# Altium project MZTS_V0.1.PrjPcb
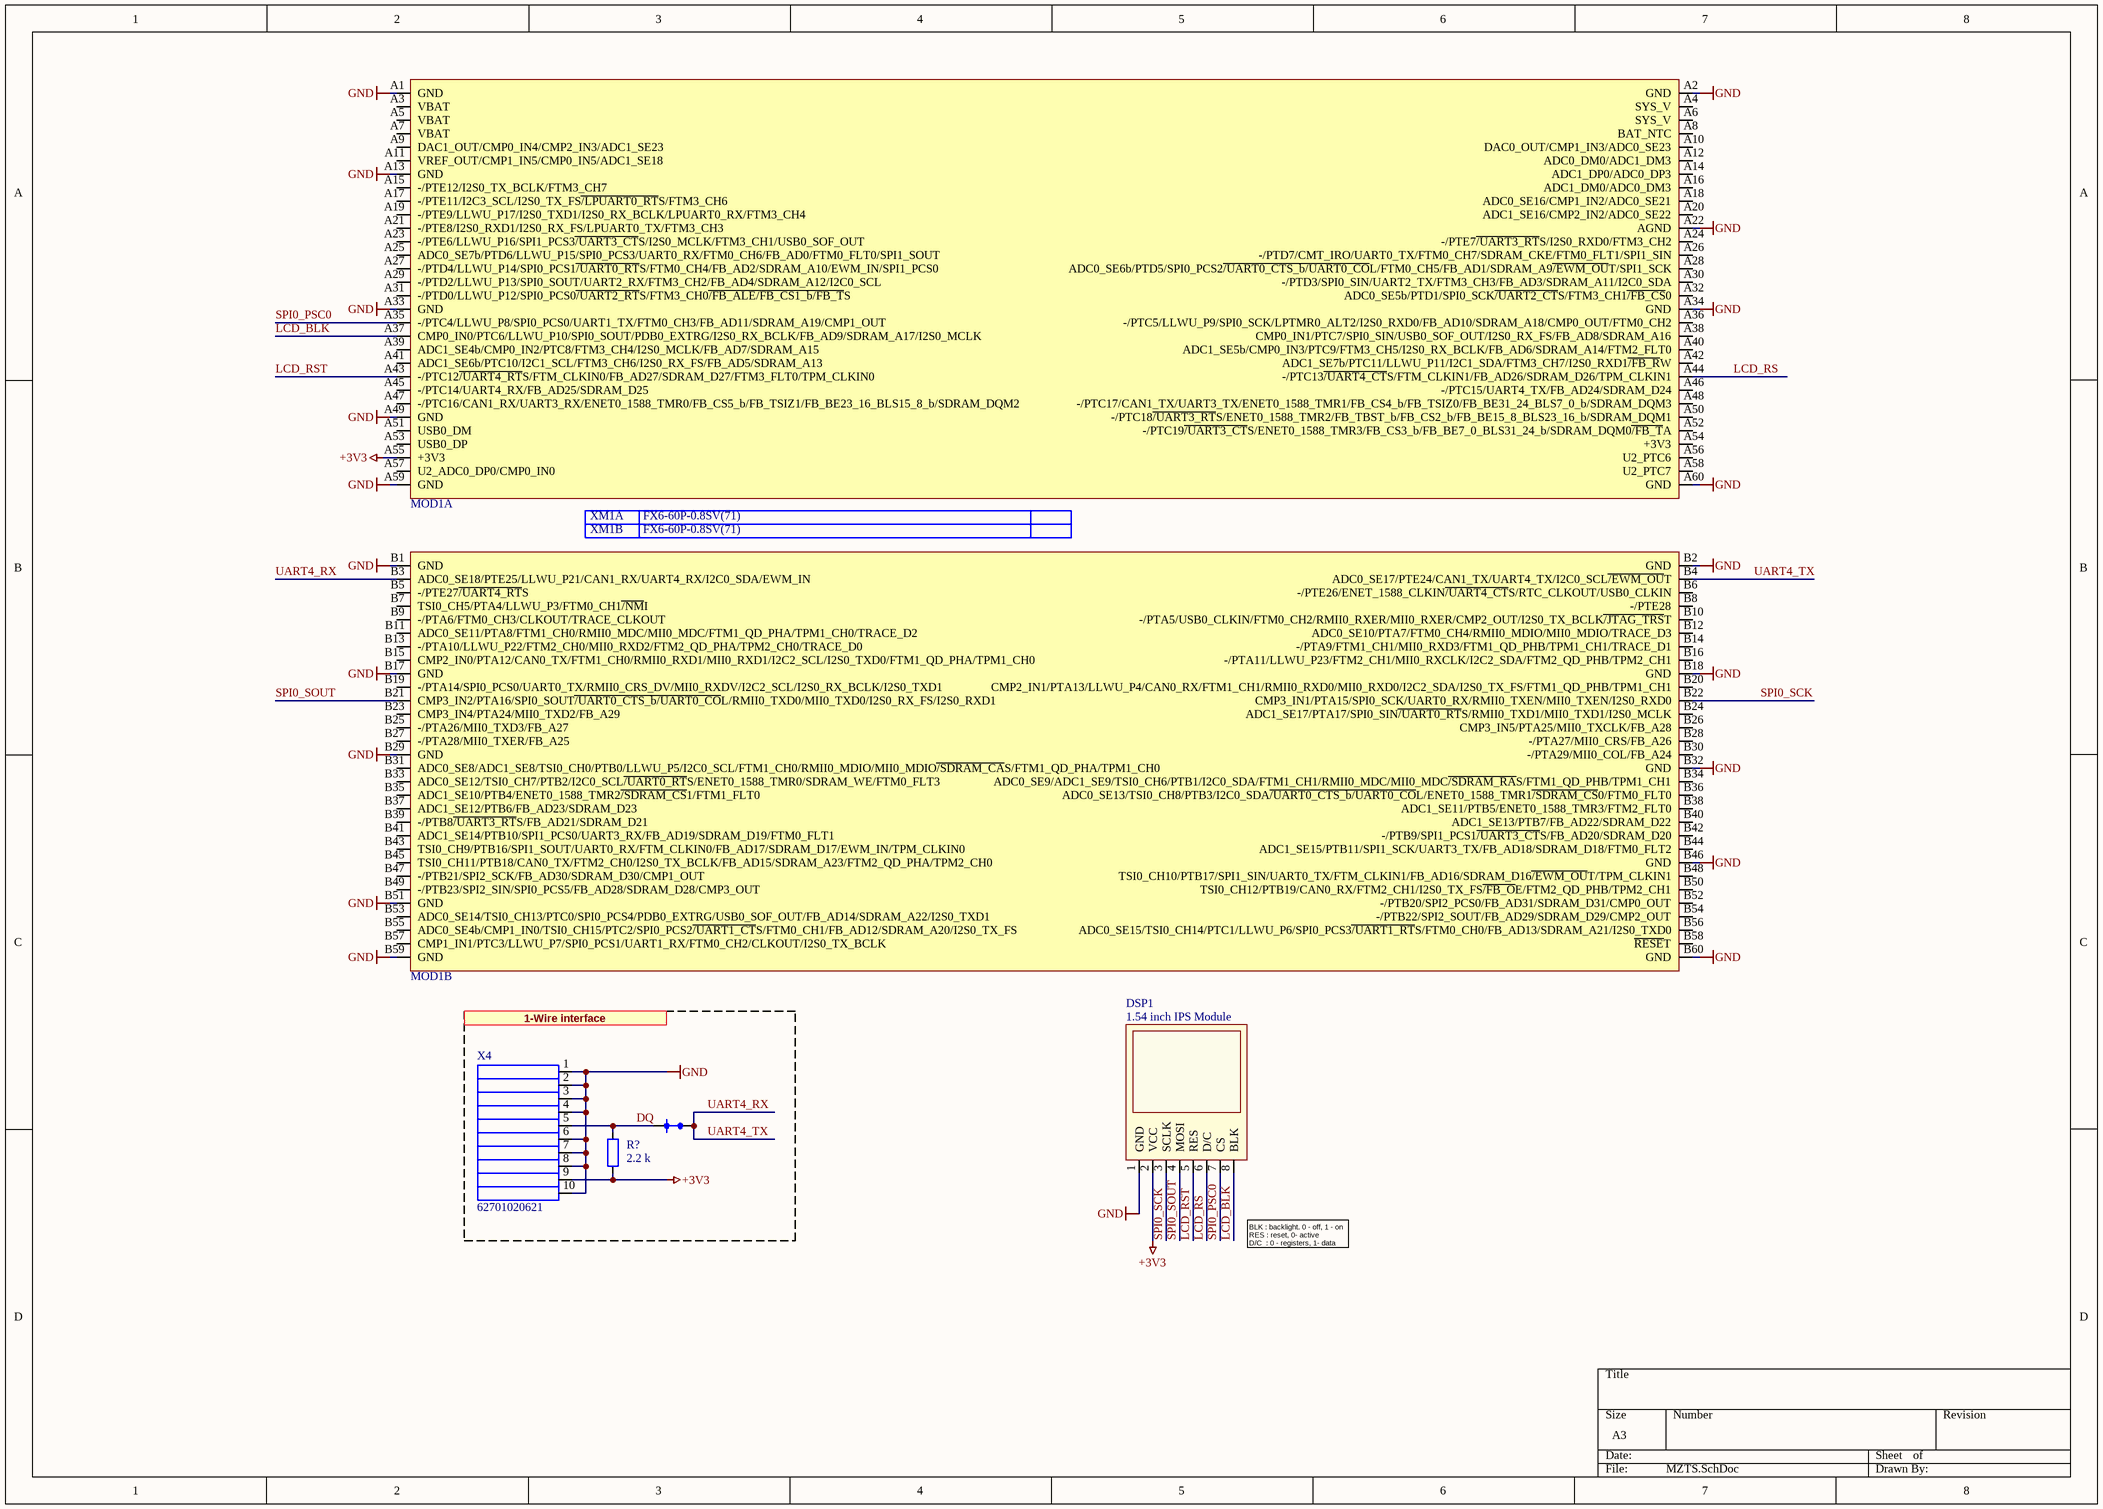
[diagram p0: MZTS.SchDoc]
1 sheet, 7 parts. Net scope: global (net labels, ports and power ports of the same name join across sheets).

## Sheet MZTS.SchDoc
size A3; SheetNumber: 1; SheetTotal: 1

### Parts
B?  Net tie 0603  [Net tee 0603]  (value not drawn)  (net tie, no BOM)
DSP1  PartName: 1.54 inch IPS Module  [1.54" IPS 240x240]  (hidden comment: 1.54_inch_IPS_Module)
MOD1  K66BLEZv1  [K66BLEZv1.0]  (value not drawn)  (parts A,B of 2)  (no BOM)
R?  value 2.2 k  [0603]  (hidden comment: Resistor)
X4  62701020621  [SHF-105-01-L-D-SM]
XM1A  FX6-60P-0.8SV(71)
XM1B  FX6-60P-0.8SV(71)

### Nets
+3V3: DSP1.2(VCC) MOD1.A55(+3V3) R?.1 X4.9
GND: DSP1.1(GND) MOD1.A1(GND) MOD1.A2(GND) MOD1.A13(GND) MOD1.A22(AGND) MOD1.A33(GND) MOD1.A34(GND) MOD1.A49(GND) MOD1.A59(GND) MOD1.A60(GND) MOD1.B1(GND) MOD1.B2(GND) MOD1.B17(GND) MOD1.B18(GND) MOD1.B29(GND) MOD1.B32(GND) MOD1.B46(GND) MOD1.B51(GND) MOD1.B59(GND) MOD1.B60(GND) X4.1 X4.2 X4.3 X4.4 X4.6 X4.7 X4.8 X4.10
DQ: B?.1 R?.2 X4.5
LCD_BLK: DSP1.8(BLK) MOD1.A37(CMP0_IN0/PTC6/LLWU_P10/SPI0_SOUT/PDB0_EXTRG/I2S0_RX_BCLK/FB_AD9/SDRAM_A17/I2S0_MCLK)
LCD_RS: DSP1.6(D/C) MOD1.A44(-/PTC13~{/UART4_CT}S/FTM_CLKIN1/FB_AD26/SDRAM_D26/TPM_CLKIN1)
LCD_RST: DSP1.5(RES) MOD1.A43(-/PTC12~{/UART4_RT}S/FTM_CLKIN0/FB_AD27/SDRAM_D27/FTM3_FLT0/TPM_CLKIN0)
SPI0_PSC0: DSP1.7(CS) MOD1.A35(-/PTC4/LLWU_P8/SPI0_PCS0/UART1_TX/FTM0_CH3/FB_AD11/SDRAM_A19/CMP1_OUT)
SPI0_SCK: DSP1.3(SCLK) MOD1.B22(CMP3_IN1/PTA15/SPI0_SCK/UART0_RX/RMII0_TXEN/MII0_TXEN/I2S0_RXD0)
SPI0_SOUT: DSP1.4(MOSI) MOD1.B21(CMP3_IN2/PTA16/SPI0_SOUT~{/UART0_CTS_b/UART0_CO}L/RMII0_TXD0/MII0_TXD0/I2S0_RX_FS/I2S0_RXD1)
UART4_RX: B?.2 MOD1.B3(ADC0_SE18/PTE25/LLWU_P21/CAN1_RX/UART4_RX/I2C0_SDA/EWM_IN) MOD1.B4(ADC0_SE17/PTE24/CAN1_TX/UART4_TX/I2C0_SCL~{/EWM_OU}T)  [also labelled UART4_TX]

Not connected (* = marked no-connect by the designer): MOD1 A3(VBAT) A4(SYS_V) A5(VBAT) A6(SYS_V) A7(VBAT) A8(BAT_NTC) A9(DAC1_OUT/CMP0_IN4/CMP2_IN3/ADC1_SE23) A10(DAC0_OUT/CMP1_IN3/ADC0_SE23) A11(VREF_OUT/CMP1_IN5/CMP0_IN5/ADC1_SE18) A12(ADC0_DM0/ADC1_DM3) A14(ADC1_DP0/ADC0_DP3) A15(-/PTE12/I2S0_TX_BCLK/FTM3_CH7) A16(ADC1_DM0/ADC0_DM3) A17(-/PTE11/I2C3_SCL/I2S0_TX_FS~{/LPUART0_RT}S/FTM3_CH6) A18(ADC0_SE16/CMP1_IN2/ADC0_SE21) A19(-/PTE9/LLWU_P17/I2S0_TXD1/I2S0_RX_BCLK/LPUART0_RX/FTM3_CH4) A20(ADC1_SE16/CMP2_IN2/ADC0_SE22) A21(-/PTE8/I2S0_RXD1/I2S0_RX_FS/LPUART0_TX/FTM3_CH3) A23(-/PTE6/LLWU_P16/SPI1_PCS3~{/UART3_CT}S/I2S0_MCLK/FTM3_CH1/USB0_SOF_OUT) A24(-/PTE7~{/UART3_RT}S/I2S0_RXD0/FTM3_CH2) A25(ADC0_SE7b/PTD6/LLWU_P15/SPI0_PCS3/UART0_RX/FTM0_CH6/FB_AD0/FTM0_FLT0/SPI1_SOUT) A26(-/PTD7/CMT_IRO/UART0_TX/FTM0_CH7/SDRAM_CKE/FTM0_FLT1/SPI1_SIN) A27(-/PTD4/LLWU_P14/SPI0_PCS1~{/UART0_RT}S/FTM0_CH4/FB_AD2/SDRAM_A10/EWM_IN/SPI1_PCS0) A28(ADC0_SE6b/PTD5/SPI0_PCS2~{/UART0_CTS_b/UART0_CO}L/FTM0_CH5/FB_AD1/SDRAM_A9~{/EWM_OU}T/SPI1_SCK) A29(-/PTD2/LLWU_P13/SPI0_SOUT/UART2_RX/FTM3_CH2/FB_AD4/SDRAM_A12/I2C0_SCL) A30(-/PTD3/SPI0_SIN/UART2_TX/FTM3_CH3/FB_AD3/SDRAM_A11/I2C0_SDA) A31(-/PTD0/LLWU_P12/SPI0_PCS0~{/UART2_RT}S/FTM3_CH0~{/FB_ALE/FB_CS1_b/FB_T}S) A32(ADC0_SE5b/PTD1/SPI0_SCK~{/UART2_CT}S/FTM3_CH1~{/FB_CS}0) A36(-/PTC5/LLWU_P9/SPI0_SCK/LPTMR0_ALT2/I2S0_RXD0/FB_AD10/SDRAM_A18/CMP0_OUT/FTM0_CH2) A38(CMP0_IN1/PTC7/SPI0_SIN/USB0_SOF_OUT/I2S0_RX_FS/FB_AD8/SDRAM_A16) A39(ADC1_SE4b/CMP0_IN2/PTC8/FTM3_CH4/I2S0_MCLK/FB_AD7/SDRAM_A15) A40(ADC1_SE5b/CMP0_IN3/PTC9/FTM3_CH5/I2S0_RX_BCLK/FB_AD6/SDRAM_A14/FTM2_FLT0) A41(ADC1_SE6b/PTC10/I2C1_SCL/FTM3_CH6/I2S0_RX_FS/FB_AD5/SDRAM_A13) A42(ADC1_SE7b/PTC11/LLWU_P11/I2C1_SDA/FTM3_CH7/I2S0_RXD1~{/FB_R}W) A45(-/PTC14/UART4_RX/FB_AD25/SDRAM_D25) A46(-/PTC15/UART4_TX/FB_AD24/SDRAM_D24) A47(-/PTC16/CAN1_RX/UART3_RX/ENET0_1588_TMR0/FB_CS5_b/FB_TSIZ1/FB_BE23_16_BLS15_8_b/SDRAM_DQM2) A48(-/PTC17/CAN1_TX/UART3_TX/ENET0_1588_TMR1/FB_CS4_b/FB_TSIZ0/FB_BE31_24_BLS7_0_b/SDRAM_DQM3) A50(-/PTC18~{/UART3_RT}S/ENET0_1588_TMR2/FB_TBST_b/FB_CS2_b/FB_BE15_8_BLS23_16_b/SDRAM_DQM1) A51(USB0_DM) A52(-/PTC19~{/UART3_CT}S/ENET0_1588_TMR3/FB_CS3_b/FB_BE7_0_BLS31_24_b/SDRAM_DQM0~{/FB_T}A) A53(USB0_DP) A54(+3V3) A56(U2_PTC6) A57(U2_ADC0_DP0/CMP0_IN0) A58(U2_PTC7) B5(-/PTE27~{/UART4_RT}S) B6(-/PTE26/ENET_1588_CLKIN~{/UART4_CT}S/RTC_CLKOUT/USB0_CLKIN) B7(TSI0_CH5/PTA4/LLWU_P3/FTM0_CH1~{/NM}I) B8(-/PTE28) B9(-/PTA6/FTM0_CH3/CLKOUT/TRACE_CLKOUT) B10(-/PTA5/USB0_CLKIN/FTM0_CH2/RMII0_RXER/MII0_RXER/CMP2_OUT/I2S0_TX_BCLK~{/JTAG_TRS}T) B11(ADC0_SE11/PTA8/FTM1_CH0/RMII0_MDC/MII0_MDC/FTM1_QD_PHA/TPM1_CH0/TRACE_D2) B12(ADC0_SE10/PTA7/FTM0_CH4/RMII0_MDIO/MII0_MDIO/TRACE_D3) B13(-/PTA10/LLWU_P22/FTM2_CH0/MII0_RXD2/FTM2_QD_PHA/TPM2_CH0/TRACE_D0) B14(-/PTA9/FTM1_CH1/MII0_RXD3/FTM1_QD_PHB/TPM1_CH1/TRACE_D1) B15(CMP2_IN0/PTA12/CAN0_TX/FTM1_CH0/RMII0_RXD1/MII0_RXD1/I2C2_SCL/I2S0_TXD0/FTM1_QD_PHA/TPM1_CH0) B16(-/PTA11/LLWU_P23/FTM2_CH1/MII0_RXCLK/I2C2_SDA/FTM2_QD_PHB/TPM2_CH1) B19(-/PTA14/SPI0_PCS0/UART0_TX/RMII0_CRS_DV/MII0_RXDV/I2C2_SCL/I2S0_RX_BCLK/I2S0_TXD1) B20(CMP2_IN1/PTA13/LLWU_P4/CAN0_RX/FTM1_CH1/RMII0_RXD0/MII0_RXD0/I2C2_SDA/I2S0_TX_FS/FTM1_QD_PHB/TPM1_CH1) B23(CMP3_IN4/PTA24/MII0_TXD2/FB_A29) B24(ADC1_SE17/PTA17/SPI0_SIN~{/UART0_RT}S/RMII0_TXD1/MII0_TXD1/I2S0_MCLK) B25(-/PTA26/MII0_TXD3/FB_A27) B26(CMP3_IN5/PTA25/MII0_TXCLK/FB_A28) B27(-/PTA28/MII0_TXER/FB_A25) B28(-/PTA27/MII0_CRS/FB_A26) B30(-/PTA29/MII0_COL/FB_A24) B31(ADC0_SE8/ADC1_SE8/TSI0_CH0/PTB0/LLWU_P5/I2C0_SCL/FTM1_CH0/RMII0_MDIO/MII0_MDIO~{/SDRAM_CA}S/FTM1_QD_PHA/TPM1_CH0) B33(ADC0_SE12/TSI0_CH7/PTB2/I2C0_SCL~{/UART0_RT}S/ENET0_1588_TMR0/SDRAM_WE/FTM0_FLT3) B34(ADC0_SE9/ADC1_SE9/TSI0_CH6/PTB1/I2C0_SDA/FTM1_CH1/RMII0_MDC/MII0_MDC~{/SDRAM_RA}S/FTM1_QD_PHB/TPM1_CH1) B35(ADC1_SE10/PTB4/ENET0_1588_TMR2~{/SDRAM_CS}1/FTM1_FLT0) B36(ADC0_SE13/TSI0_CH8/PTB3/I2C0_SDA~{/UART0_CTS_b/UART0_CO}L/ENET0_1588_TMR1~{/SDRAM_CS}0/FTM0_FLT0) B37(ADC1_SE12/PTB6/FB_AD23/SDRAM_D23) B38(ADC1_SE11/PTB5/ENET0_1588_TMR3/FTM2_FLT0) B39(-/PTB8~{/UART3_RT}S/FB_AD21/SDRAM_D21) B40(ADC1_SE13/PTB7/FB_AD22/SDRAM_D22) B41(ADC1_SE14/PTB10/SPI1_PCS0/UART3_RX/FB_AD19/SDRAM_D19/FTM0_FLT1) B42(-/PTB9/SPI1_PCS1~{/UART3_CT}S/FB_AD20/SDRAM_D20) B43(TSI0_CH9/PTB16/SPI1_SOUT/UART0_RX/FTM_CLKIN0/FB_AD17/SDRAM_D17/EWM_IN/TPM_CLKIN0) B44(ADC1_SE15/PTB11/SPI1_SCK/UART3_TX/FB_AD18/SDRAM_D18/FTM0_FLT2) B45(TSI0_CH11/PTB18/CAN0_TX/FTM2_CH0/I2S0_TX_BCLK/FB_AD15/SDRAM_A23/FTM2_QD_PHA/TPM2_CH0) B47(-/PTB21/SPI2_SCK/FB_AD30/SDRAM_D30/CMP1_OUT) B48(TSI0_CH10/PTB17/SPI1_SIN/UART0_TX/FTM_CLKIN1/FB_AD16/SDRAM_D16~{/EWM_OU}T/TPM_CLKIN1) B49(-/PTB23/SPI2_SIN/SPI0_PCS5/FB_AD28/SDRAM_D28/CMP3_OUT) B50(TSI0_CH12/PTB19/CAN0_RX/FTM2_CH1/I2S0_TX_FS~{/FB_O}E/FTM2_QD_PHB/TPM2_CH1) B52(-/PTB20/SPI2_PCS0/FB_AD31/SDRAM_D31/CMP0_OUT) B53(ADC0_SE14/TSI0_CH13/PTC0/SPI0_PCS4/PDB0_EXTRG/USB0_SOF_OUT/FB_AD14/SDRAM_A22/I2S0_TXD1) B54(-/PTB22/SPI2_SOUT/FB_AD29/SDRAM_D29/CMP2_OUT) B55(ADC0_SE4b/CMP1_IN0/TSI0_CH15/PTC2/SPI0_PCS2~{/UART1_CT}S/FTM0_CH1/FB_AD12/SDRAM_A20/I2S0_TX_FS) B56(ADC0_SE15/TSI0_CH14/PTC1/LLWU_P6/SPI0_PCS3~{/UART1_RT}S/FTM0_CH0/FB_AD13/SDRAM_A21/I2S0_TXD0) B57(CMP1_IN1/PTC3/LLWU_P7/SPI0_PCS1/UART1_RX/FTM0_CH2/CLKOUT/I2S0_TX_BCLK) B58(~{RESE}T)

### Notes on the sheet
- 1-Wire interface
- BLK : backlight. 0 - off, 1 - on
  RES : reset, 0- active
  D/C  : 0 - registers, 1- data

### Library data of the parts
DSP1 = 1.54_inch_IPS_Module: 1.54-inch color screen,support 65K color display, 4-line SPI interface, 240x240 resolution, 32.00x43.72 mm; PartNum: MSP1541; Distributor: Aliexpress; Price: 7.36
MOD1 = K66BLEZv1: Manufacturer: BARDUVA; PartName: K66BLEZv1
R? = RMCF0603FT2K20: 2.2 kOhms, ±1%, 0.1W, 1/10W, Thick Film, ±100ppm/°C, 0603 (1608 Metric), -55°C ~ 155°C, Automotive AEC-Q200; Manufacturer: Stackpole Electronics Inc.; PartNum: RMCF0603FT2K20CT-ND; Voltage: 75V; Distributor: Digi-Key; Price: 0.00690; Tolerance: ±1%; PartName: RMCF0603FT2K20; Part Number: RMCF0603FT2K20; Temperature Coefficient: ±100ppm/°C; Operating Temperature: -55°C ~ 155°C; Power (Watts): 0.1W, 1/10W; Features: Automotive AEC-Q200; Package / Case: 0603 (1608 Metric)
X4 = 62701020621: 10 Positions Header Connector 0.050" (1.27mm) Surface Mount Gold; Manufacturer: Wurth; Distributor: we-online.com; Price: 4.36$; PartNum: 62701020621; PartName: 62701020621
XM1A XM1B = BOM item: CONN HEADER 60POS .8MM SMD GOLD; Manufacturer: Hirose Electric Co Ltd; PartNum: H10787-ND; Distributor: Digi-Key; PartName: FX6-60P-0.8SV(71)